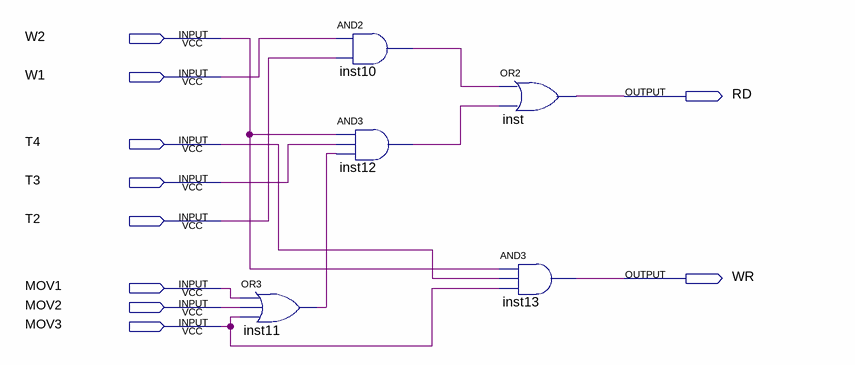
[diagram p0: schematic sheet]
// Quartus schematic WNR.bdf as structural Verilog: 5 symbols, 10 pins
module WNR (
  input  W2,
  input  W1,
  input  T4,
  input  T3,
  input  T2,
  input  MOV1,
  input  MOV2,
  input  MOV3,
  output RD,
  output WR
);

  wire inst10_out, inst11_out, inst12_out;

  or inst11 (inst11_out, MOV1, MOV2, MOV3);
  and inst10 (inst10_out, W1, T2);
  and inst12 (inst12_out, W2, T3, inst11_out);
  or inst (RD, inst10_out, inst12_out);
  and inst13 (WR, W2, T4, MOV3);
endmodule
